# EAGLE schematic 8steps (EAGLE 7.4.0)
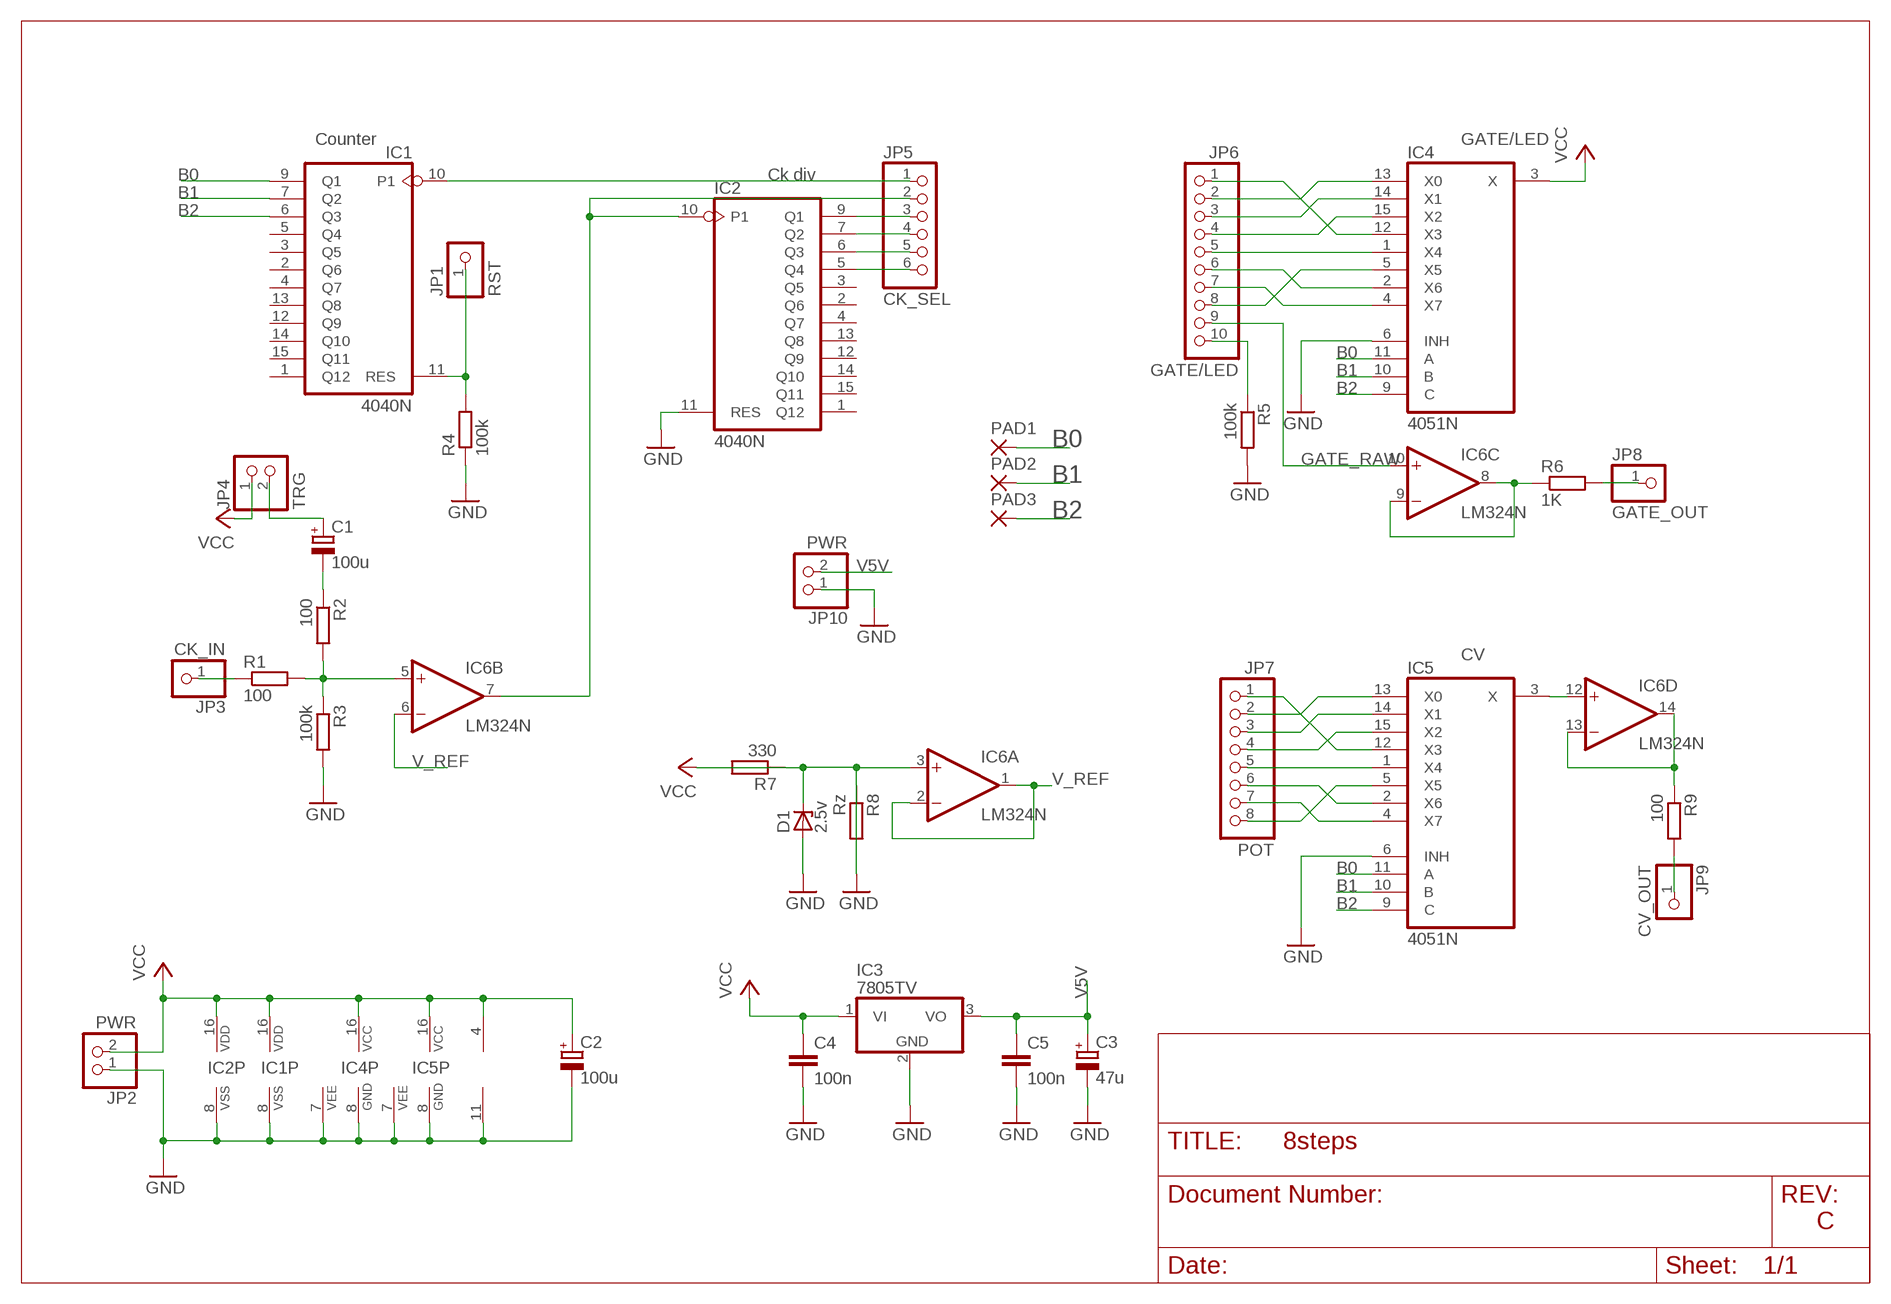
[diagram p0: schematic, sheet 1]

## Parts
C1  100u  CPOL-EUE2.5-7  [E2,5-7]
C2  100u  CPOL-EUE2.5-7  [E2,5-7]
C3  47u  CPOL-EUE2.5-7  [E2,5-7]
C4  100n  C-EU050-025X075  [C050-025X075]
C5  100n  C-EU050-025X075  [C050-025X075]
D1  2.5v  ZENER-DIODEZD-2.5  [ZDIO-2.5]
IC1  4040N  [DIL16]
IC2  4040N  [DIL16]
IC3  7805TV  [TO220V]
IC4  4051N  [DIL16]
IC5  4051N  [DIL16]
IC6  LM324N  [DIL14]
JP1  RST  PINHD-1X1  [1X01]
JP2  PWR  PINHD-1X2  [1X02]
JP3  CK_IN  PINHD-1X1  [1X01]
JP4  TRG  PINHD-1X2  [1X02]
JP5  CK_SEL  PINHD-1X6  [1X06]
JP6  GATE/LED  PINHD-1X10  [1X10]
JP7  POT  PINHD-1X8  [1X08]
JP8  GATE_OUT  PINHD-1X1  [1X01]
JP9  CV_OUT  PINHD-1X1  [1X01]
JP10  PWR  PINHD-1X2  [1X02]
PAD1  WIREPADSMD1,27-254  [SMD1,27-2,54]
PAD2  WIREPADSMD1,27-254  [SMD1,27-2,54]
PAD3  WIREPADSMD1,27-254  [SMD1,27-2,54]
R1  100  R-EU_0207/2V  [0207/2V]
R2  100  R-EU_0207/2V  [0207/2V]
R3  100k  R-EU_0204/7  [0204/7]
R4  100k  R-EU_0207/2V  [0207/2V]
R5  100k  R-EU_0207/2V  [0207/2V]
R6  1K  R-EU_0207/2V  [0207/2V]
R7  330  R-EU_0207/2V  [0207/2V]
R8  Rz  R-EU_0207/2V  [0207/2V]
R9  100  R-EU_0207/2V  [0207/2V]

## Nets
B0: IC1.9(Q1) IC4.11(A) IC5.11(A) PAD1.1(P)
B1: IC1.7(Q2) IC4.10(B) IC5.10(B) PAD2.1(P)
B2: IC1.6(Q3) IC4.9(C) IC5.9(C) PAD3.1(P)
GATE_RAW: IC6.10(C:+IN) JP6.9
GND: C2.- C3.- C4.2 C5.2 D1.A IC1.8(VSS) IC2.8(VSS) IC2.11(RES) IC3.2(GND) IC4.6(INH) IC4.7(VEE) IC4.8(GND) IC5.6(INH) IC5.7(VEE) IC5.8(GND) IC6.11(P:V-) JP2.1 JP10.1 R3.2 R4.1 R5.2 R8.1
N$1: D1.C IC6.3(A:+IN) R7.2 R8.2
N$2: C1.- R2.1
N$3: IC5.3(X) IC6.12(D:+IN)
N$4: IC2.10(P1) IC6.7(B:OUT) JP5.2
N$5: IC2.9(Q1) JP5.3
N$6: IC2.7(Q2) JP5.4
N$7: IC2.6(Q3) JP5.5
N$8: IC2.5(Q4) JP5.6
N$9: IC1.10(P1) JP5.1
N$10: IC4.12(X3) JP6.1
N$11: IC4.13(X0) JP6.2
N$12: IC4.14(X1) JP6.3
N$13: IC4.15(X2) JP6.4
N$14: IC4.1(X4) JP6.5
N$15: IC4.4(X7) JP6.7
N$16: IC4.2(X6) JP6.6
N$17: IC4.5(X5) JP6.8
N$18: IC5.12(X3) JP7.1
N$19: IC5.13(X0) JP7.2
N$20: IC5.14(X1) JP7.3
N$21: IC5.15(X2) JP7.4
N$22: IC5.1(X4) JP7.5
N$23: IC5.4(X7) JP7.7
N$25: IC5.5(X5) JP7.8
N$26: IC6.13(D:-IN) IC6.14(D:OUT) R9.1
N$27: JP9.1 R9.2
N$28: JP6.10 R5.1
N$29: IC1.11(RES) JP1.1 R4.2
N$30: IC6.8(C:OUT) IC6.9(C:-IN) R6.1
N$31: JP8.1 R6.2
N$32: IC5.2(X6) JP7.6
N$33: IC6.5(B:+IN) R1.2 R2.2 R3.1
N$34: C1.+ JP4.2
N$35: JP3.1 R1.1
V5V: C3.+ C5.1 IC3.3(VO) JP10.2
V_REF: IC6.1(A:OUT) IC6.2(A:-IN) IC6.6(B:-IN)
VCC: C2.+ C4.1 IC1.16(VDD) IC2.16(VDD) IC3.1(VI) IC4.3(X) IC4.16(VCC) IC5.16(VCC) IC6.4(P:V+) JP2.2 JP4.1 R7.1
Unconnected: IC1.1(Q12) IC1.2(Q6) IC1.3(Q5) IC1.4(Q7) IC1.5(Q4) IC1.12(Q9) IC1.13(Q8) IC1.14(Q10) IC1.15(Q11) IC2.1(Q12) IC2.2(Q6) IC2.3(Q5) IC2.4(Q7) IC2.12(Q9) IC2.13(Q8) IC2.14(Q10) IC2.15(Q11)

## Notes on the sheet
- Counter | GATE/LED
- Ck div
- CV
- C

## Library data of the parts
C1-C3 = rcl:CPOL-EU: POLARIZED CAPACITOR, European symbol
C4 C5 = rcl:C-EU: CAPACITOR, European symbol
D1 = diode:ZENER-DIODE: Z-Diode
IC1 IC2 = 40xx:4040: 12-stage binary/ripple COUNTER
IC3 = linear:78*: Positive VOLTAGE REGULATOR Source: http://cache.national.com/ds/LM/LM78L05.pdf http://www.fairchildsemi.com/ds/LM/LM7805.pdf
IC4 IC5 = 40xx:4051: 8-channel ANALOG MULTIPLEXER
IC6 = linear:LM324: OP AMP
JP1 JP3 JP8 JP9 = pinhead:PINHD-1X1: PIN HEADER
JP2 JP4 JP10 = pinhead:PINHD-1X2: PIN HEADER
JP5 = pinhead:PINHD-1X6: PIN HEADER
JP6 = pinhead:PINHD-1X10: PIN HEADER
JP7 = pinhead:PINHD-1X8: PIN HEADER
PAD1-PAD3 = wirepad:WIREPAD: Wire PAD connect wire on PCB
R1-R9 = rcl:R-EU_: RESISTOR, European symbol

## Net classes
0 default: clearance 0.205 mm